# Altium schematic sheet 8button-8eopixel.SchDoc
size A; SheetNumber: 1; SheetTotal: 1
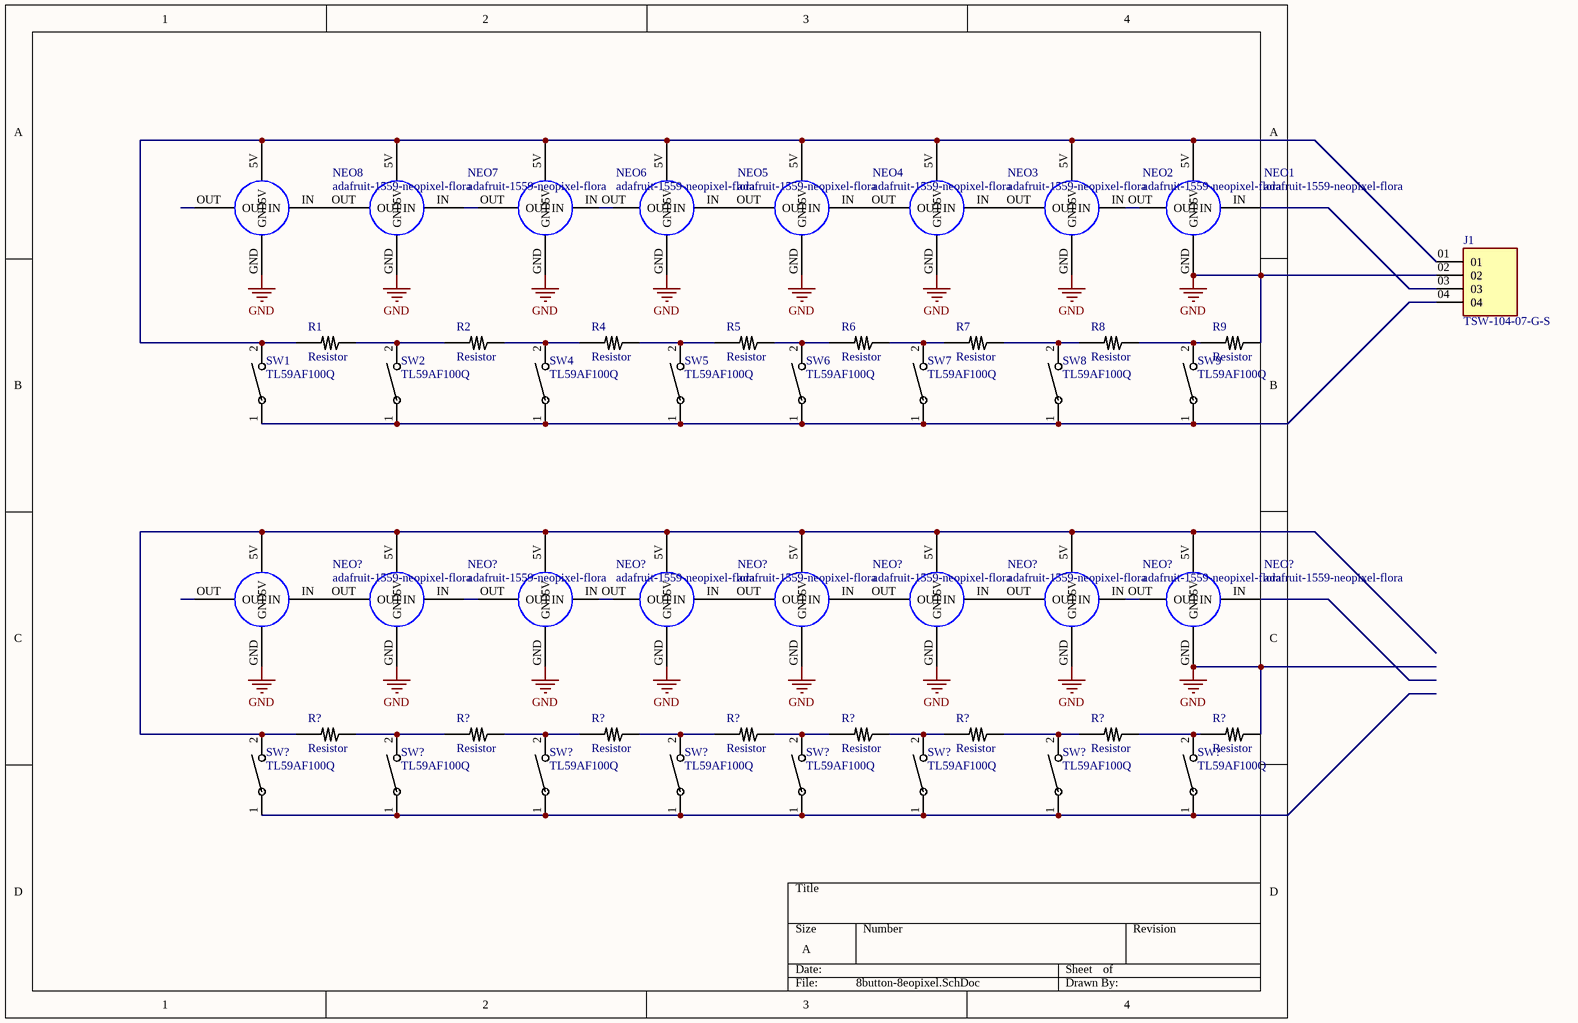
[diagram p0: 8button-8eopixel.SchDoc]

## Parts
(Parts that share a designator on the sheet are numbered #1, #2 ... from top to bottom, then left to right.)
J1  TSW-104-07-G-S  [SAMTEC_TSW-104-07-G-S]
NEO1  adafruit-1559-neopixel-flora  [adafruit-1559-neopixel-flora]
NEO2  adafruit-1559-neopixel-flora  [adafruit-1559-neopixel-flora]
NEO3  adafruit-1559-neopixel-flora  [adafruit-1559-neopixel-flora]
NEO4  adafruit-1559-neopixel-flora  [adafruit-1559-neopixel-flora]
NEO5  adafruit-1559-neopixel-flora  [adafruit-1559-neopixel-flora]
NEO6  adafruit-1559-neopixel-flora  [adafruit-1559-neopixel-flora]
NEO7  adafruit-1559-neopixel-flora  [adafruit-1559-neopixel-flora]
NEO8  adafruit-1559-neopixel-flora  [adafruit-1559-neopixel-flora]
NEO?#1  adafruit-1559-neopixel-flora  [adafruit-1559-neopixel-flora]
NEO?#2  adafruit-1559-neopixel-flora  [adafruit-1559-neopixel-flora]
NEO?#3  adafruit-1559-neopixel-flora  [adafruit-1559-neopixel-flora]
NEO?#4  adafruit-1559-neopixel-flora  [adafruit-1559-neopixel-flora]
NEO?#5  adafruit-1559-neopixel-flora  [adafruit-1559-neopixel-flora]
NEO?#6  adafruit-1559-neopixel-flora  [adafruit-1559-neopixel-flora]
NEO?#7  adafruit-1559-neopixel-flora  [adafruit-1559-neopixel-flora]
NEO?#8  adafruit-1559-neopixel-flora  [adafruit-1559-neopixel-flora]
R1  Resistor  [thruhole resistor]
R2  Resistor  [thruhole resistor]
R4  Resistor  [thruhole resistor]
R5  Resistor  [thruhole resistor]
R6  Resistor  [thruhole resistor]
R7  Resistor  [thruhole resistor]
R8  Resistor  [thruhole resistor]
R9  Resistor  [thruhole resistor]
R?#1  Resistor  [thruhole resistor]
R?#2  Resistor  [thruhole resistor]
R?#3  Resistor  [thruhole resistor]
R?#4  Resistor  [thruhole resistor]
R?#5  Resistor  [thruhole resistor]
R?#6  Resistor  [thruhole resistor]
R?#7  Resistor  [thruhole resistor]
R?#8  Resistor  [thruhole resistor]
SW1  TL59AF100Q  [SW_TL59AF100Q_EWI]
SW2  TL59AF100Q  [SW_TL59AF100Q_EWI]
SW4  TL59AF100Q  [SW_TL59AF100Q_EWI]
SW5  TL59AF100Q  [SW_TL59AF100Q_EWI]
SW6  TL59AF100Q  [SW_TL59AF100Q_EWI]
SW7  TL59AF100Q  [SW_TL59AF100Q_EWI]
SW8  TL59AF100Q  [SW_TL59AF100Q_EWI]
SW9  TL59AF100Q  [SW_TL59AF100Q_EWI]
SW?#1  TL59AF100Q  [SW_TL59AF100Q_EWI]
SW?#2  TL59AF100Q  [SW_TL59AF100Q_EWI]
SW?#3  TL59AF100Q  [SW_TL59AF100Q_EWI]
SW?#4  TL59AF100Q  [SW_TL59AF100Q_EWI]
SW?#5  TL59AF100Q  [SW_TL59AF100Q_EWI]
SW?#6  TL59AF100Q  [SW_TL59AF100Q_EWI]
SW?#7  TL59AF100Q  [SW_TL59AF100Q_EWI]
SW?#8  TL59AF100Q  [SW_TL59AF100Q_EWI]

## Nets
GND: J1.02 NEO1.GND NEO2.GND NEO3.GND NEO4.GND NEO5.GND NEO6.GND NEO7.GND NEO8.GND NEO?#1.GND NEO?#2.GND NEO?#3.GND NEO?#4.GND NEO?#5.GND NEO?#6.GND NEO?#7.GND NEO?#8.GND R9.1 R?#8.1
NetJ1_01: J1.01 NEO1.5V NEO2.5V NEO3.5V NEO4.5V NEO5.5V NEO6.5V NEO7.5V NEO8.5V R1.2 SW1.2
NetJ1_03: J1.03 NEO1.IN
NetJ1_04: J1.04 SW1.1 SW2.1 SW4.1 SW5.1 SW6.1 SW7.1 SW8.1 SW9.1
NetNEO1_OUT: NEO1.OUT NEO2.IN
NetNEO2_OUT: NEO2.OUT NEO3.IN
NetNEO3_OUT: NEO3.OUT NEO4.IN
NetNEO4_OUT: NEO4.OUT NEO5.IN
NetNEO5_OUT: NEO5.OUT NEO6.IN
NetNEO6_OUT: NEO6.OUT NEO7.IN
NetNEO7_OUT: NEO7.OUT NEO8.IN
NetNEO?#1_5V: NEO?#1.5V NEO?#2.5V NEO?#3.5V NEO?#4.5V NEO?#5.5V NEO?#6.5V NEO?#7.5V NEO?#8.5V R?#1.2 SW?#1.2
NetNEO?#1_IN: NEO?#1.IN NEO?#2.OUT
NetNEO?#2_IN: NEO?#2.IN NEO?#3.OUT
NetNEO?#3_IN: NEO?#3.IN NEO?#4.OUT
NetNEO?#4_IN: NEO?#4.IN NEO?#5.OUT
NetNEO?#5_IN: NEO?#5.IN NEO?#6.OUT
NetNEO?#6_IN: NEO?#6.IN NEO?#7.OUT
NetNEO?#7_IN: NEO?#7.IN NEO?#8.OUT
NetR1_1: R1.1 R2.2 SW2.2
NetR2_1: R2.1 R4.2 SW4.2
NetR4_1: R4.1 R5.2 SW5.2
NetR5_1: R5.1 R6.2 SW6.2
NetR6_1: R6.1 R7.2 SW7.2
NetR7_1: R7.1 R8.2 SW8.2
NetR8_1: R8.1 R9.2 SW9.2
NetR?#1_1: R?#1.1 R?#2.2 SW?#2.2
NetR?#2_1: R?#2.1 R?#3.2 SW?#3.2
NetR?#3_1: R?#3.1 R?#4.2 SW?#4.2
NetR?#4_1: R?#4.1 R?#5.2 SW?#5.2
NetR?#5_1: R?#5.1 R?#6.2 SW?#6.2
NetR?#6_1: R?#6.1 R?#7.2 SW?#7.2
NetR?#7_1: R?#7.1 R?#8.2 SW?#8.2
NetSW?#1_1: SW?#1.1 SW?#2.1 SW?#3.1 SW?#4.1 SW?#5.1 SW?#6.1 SW?#7.1 SW?#8.1

Not connected (* = marked no-connect by the designer): NEO8 OUT; NEO?#1 OUT; NEO?#8 IN

## Library data of the parts
J1 = TSW-104-07-G-S: <a href="https://pricing.snapeda.com/parts/TSW-104-07-G-S/Samtec/view-part?ref=eda">Check availability</a>; MP: altium_native_batch; Package: None; Price: None; Value: *; Availability: Unavailable
SW1 SW2 SW4-SW9 SW?#1-SW?#8 = TL59AF100Q: No Description Available; Mfr_Name: E-Switch; Copyright: Copyright (C) 2024 Ultra Librarian. All rights reserved.; Manufacturer_Part_Number: TL59AF100Q; RefDes: RefDes; Type: DEV